# Altium schematic sheet Half_Bridge_Driver.SchDoc
size A4; SheetNumber: 14; SheetTotal: 16
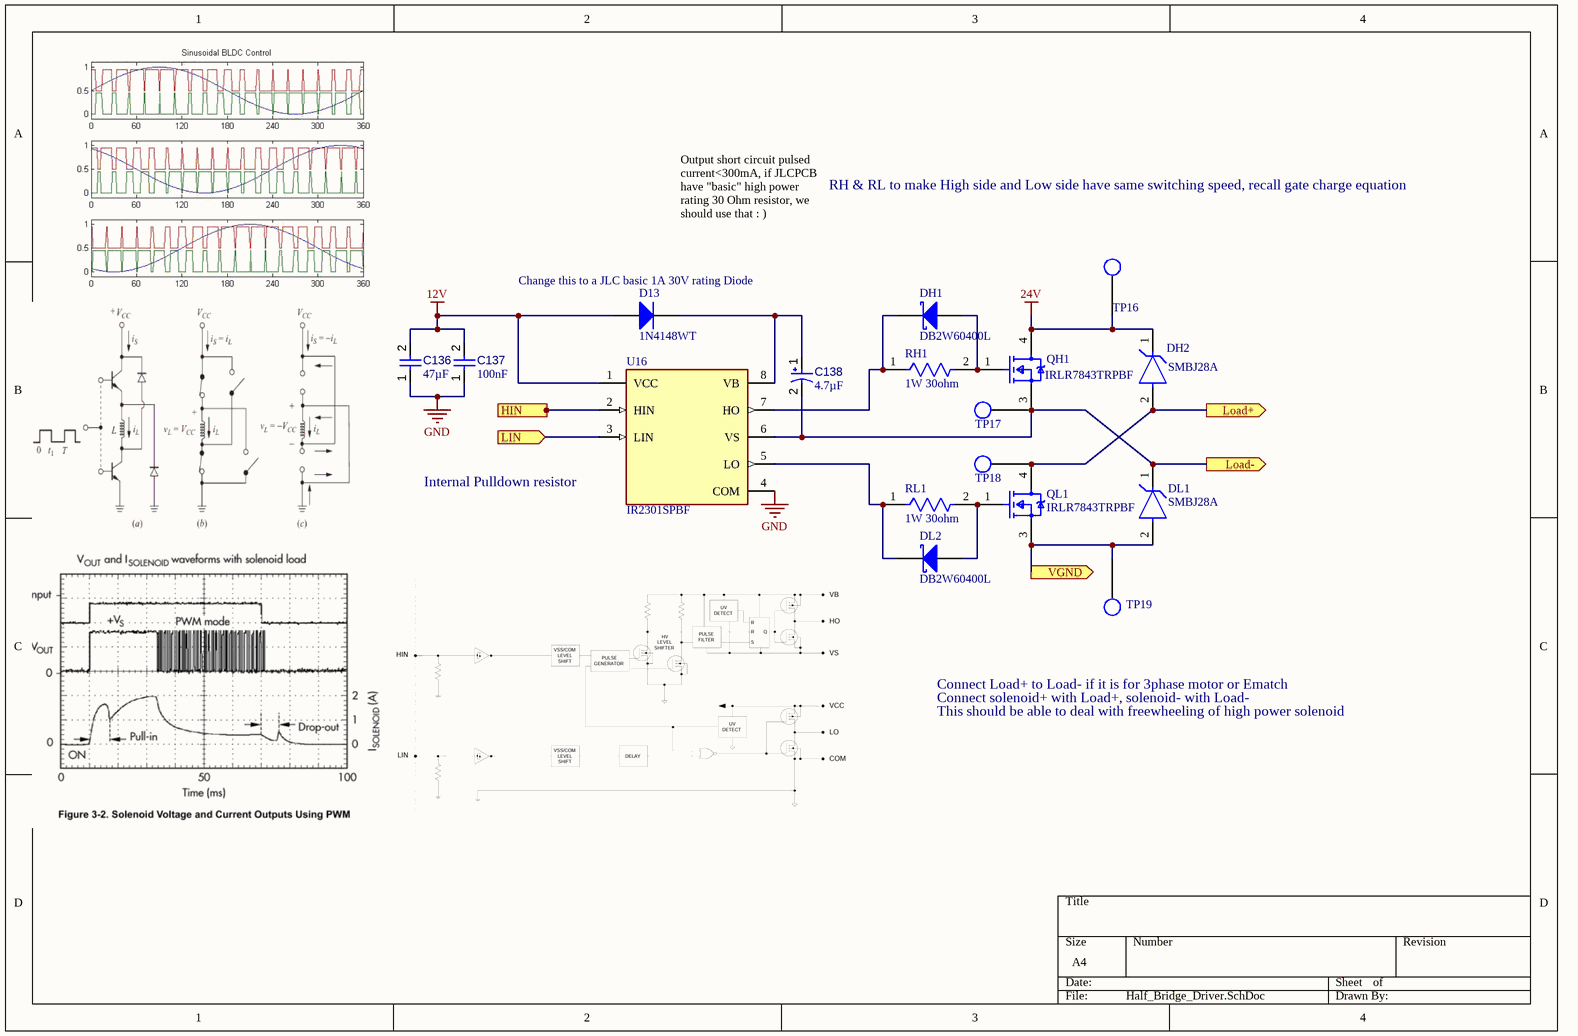
[diagram p0: Half_Bridge_Driver.SchDoc]

## Parts
C136  value 47µF  [CAPC0805(2012)145_L]  (hidden comment: Capacitor 47µF +/-40% 6.3V 0805)
C137  value 100nF  [CAPC2013X95X50LL10T25]  (hidden comment: Capacitor 100 nF +/-10% 50 V 0805)
C138  value 4.7µF  [CAPPR55-200-1100X500X1200]  (hidden comment: ECA1HM4R7)
D13  1N4148WT  [FAIR-SOD-523F-2_V]
DH1  DB2W60400L  [PNSC-Mini2-F3-B-2_V]
DH2  SMBJ28A  [FP-SMBJ-MFG]
DL1  SMBJ28A  [FP-SMBJ-MFG]
DL2  DB2W60400L  [PNSC-Mini2-F3-B-2_V]
QH1  IRLR7843TRPBF  [FP-PG-TO252-3-MFG]
QL1  IRLR7843TRPBF  [FP-PG-TO252-3-MFG]
RH1  1W 30ohm  [FP-RMCF2512-IPC_C]
RL1  1W 30ohm  [FP-RMCF2512-IPC_C]
TP16  BURPG_TestPoint1  [BURPG_TestPoint1]  (value not drawn)  (no BOM)
TP17  BURPG_TestPoint1  [BURPG_TestPoint1]  (value not drawn)  (no BOM)
TP18  BURPG_TestPoint1  [BURPG_TestPoint1]  (value not drawn)  (no BOM)
TP19  BURPG_TestPoint1  [BURPG_TestPoint1]  (value not drawn)  (no BOM)
U16  IR2301SPBF  [FP-PG-DSO-8-IPC_C]

## Ports
HIN (in), LIN (in), Load+ (out), Load- (out), VGND (out)

## Nets
12V: C136.2 C137.2 D13.2(A) U16.1(VCC)
24V: DH2.1(C) QH1.4(DRAIN) TP16.1
GND: C136.1 C137.1 U16.4(COM)
HIN: U16.2(HIN) ; port HIN
LIN: U16.3(LIN) ; port LIN
Load+: DH2.2(A) QL1.4(DRAIN) TP18.1 ; port Load+
Load-: C138.2 DL1.1(C) QH1.3(SOURCE) TP17.1 U16.6(VS) ; port Load-
VGND: DL1.2(A) QL1.3(SOURCE) TP19.1 ; port VGND
NetC138_1: C138.1 D13.1(K) U16.8(VB)
NetDH1_1: DH1.1(A) QH1.1(GATE) RH1.2
NetDH1_2: DH1.2(K) RH1.1 U16.7(HO)
NetDL2_1: DL2.1(A) QL1.1(GATE) RL1.2
NetDL2_2: DL2.2(K) RL1.1 U16.5(LO)

## Notes on the sheet
- Output short circuit pulsed current<300mA, if JLCPCB have "basic" high power rating 30 Ohm resistor, we should use that : )
- RH & RL to make High side and Low side have same switching speed, recall gate charge equation
- (near D13) Change this to a JLC basic 1A 30V rating Diode
- (near U16) Internal Pulldown resistor
- Connect Load+ to Load- if it is for 3phase motor or Ematch
- Connect solenoid+ with Load+, solenoid- with Load-
- This should be able to deal with freewheeling of high power solenoid

## Library data of the parts
C136 = CMP-001-00082-4: Chip Capacitor, 47µF +/-40%, 6.3V, 0805, Thickness 1.45 mm; Tolerance: 10%; Min Operating Temperature: -55°C; Max Operating Temperature: 85°C; Case/Package: 0805; Pins: 2; Mounting Technology: SMT; Voltage Rating: 6.3V
C137 = CMP-001-00018-6: Chip Capacitor, 100 nF, +/- 10%, 50 V, 0805 (2012 Metric); Capacitor Type: Ceramic; Voltage Rating: 50V; Pins: 2; Max Operating Temperature: 125°C; Min Operating Temperature: -55°C; Mounting Technology: SM; Case/Package: 0805; RoHS Compliant: True; Tolerance: 10%
C138 = CMP-001-00033-7: Aluminum Electrolytic Capacitor, 4.7 uF, +/- 20%, 50 V, -40 to 85 degC, 2-Pin THD, RoHS, Bulk; Manufacturer: Panasonic; Ripple Current (AC): 45mA; Voltage Rating: 50V; Diameter: 5mm; Min Operating Temperature: -40°C; Lead Pitch: 2mm; Package Quantity: 200; Capacitor Type: Electrolytic; Ripple Current: 45mA; Datasheet Version: Rev. 05, 10/2016; Case/Package: Radial; Pins: 2; Manufacturer URL: http://www.panasonic.com/; RoHS Compliant: True; Package Description: 2-Pin Radial Lead, Dia 5 mm, Height 12 mm; Packaging: Bulk; Datasheet URL: https://industrial.panasonic.com/cdbs/www-data/pdf/RDF0000/ABA0000C1218.pdf; Mounting Technology: TH; Max Operating Temperature: 85°C; Package Reference: CAPPR55-200-1100X500X1200; Tolerance: 20%
D13 = CMP-0881-00001-1: High Conductance Fast Switching Diode, 75 V, -55 to 150 degC, 2-Pin SOD523F, RoHS; Manufacturer: Fairchild Semiconductor; IR (VR: 75 V)=5 uA Max.; VF: 1 V Max.; BVR (IR: 5 uA)=75 V Min.; CO: 4 pF Max.; DatasheetVersion: Rev. A2; ComponentLink1Description: Manufacturer URL; PackageDescription: 2-Pin Surface Mount Device, Body 1.2 x 0.8 mm, Height 0.7 mm; ComponentLink2URL: http://www.fairchildsemi.com/ds/1N/1N4148WT.pdf; ComponentLink2Description: Datasheet; PartNumber: 1N4148WT; ComponentLink1URL: http://www.fairchildsemi.com/; Temperature Range: -55 to 150 degC; Mounting Technology: Surface Mount; PackageReference: SOD-523F-2; RoHS: TRUE
DH1 DL2 = CMP-2000-06140-1: Schottky Barrier Diode, 60 V (VR), 2 A (IF), -40 to 85 degC, 2-Pin SODFL (Mini2-F3-B), RoHS, Tape and Reel; Manufacturer: Panasonic; Peak Reverse Voltage: 60V; Forward Continuous Current: 2A; Maximum Reverse Leakage Current: 300uA; Max Surge Current: 30A; Configuration: Single; Recovery Time: 12ns; Forward Voltage Drop: 0.66V; Maximum Diode Capacitance: 38pF; Package / Case: SC-109B-2; Mounting Style: SMD/SMT; Maximum Operating Temperature: +85C; Factory Pack Quantity: 3000; Product: GeneralPurposeDiodes; Package Description: 2-Pin Small Outline Transistor Flat Lead, Body 2.6 x 1.6 mm; Datasheet Version: Rev. 3, 04/2013; Package Reference: Mini2-F3-B-2; RoHS: Details; Product Category: Diodes-GeneralPurpose,Power,Switching; Minimum Operating Temperature: -40C; Packaging: Reel; Operating Temperature Range: -40Cto+85C; Mounting Technology: SurfaceMount; Datasheet URL: http://www.semicon.panasonic.co.jp/ds4/DB2W604_E.pdf; Manufacturer URL: http://www.panasonic.com/; Brand: Panasonic
DH2 DL1 = CMP-08607-000081-1: TVS DIODE 28V 45.4V DO214AA; Manufacturer: Littelfuse Inc; Breakdown Voltage: 31.1V; Direction: Unidirectional; Number Of Channels: 1; Peak Pulse Power: 600W; Max Junction Temp: +150°C; Peak Pulse Current: 13.3A; Temperature: -65°C to +150°C; Category: Diode; RoHS: TRUE; Height: 2.61mm; Reverse Standoff Voltage: 28V; Device Class L1: Circuit Protection; Temperature Range Low: -65°C; ComponentLink2Description: Datasheet; Digikey Description: TVS DIODE 28V 45.4V DO214AA; Automotive: No; Package: SMBJ; Mouser Description: Littelfuse SMBJ28A, Uni-Directional TVS Diode, 600W, 2-Pin DO-214AA; ComponentLink2URL: https://www.littelfuse.com/~/media/electronics/datasheets/tvs_diodes/littelfuse_tvs_diode_smbj_datasheet.pdf.pdf; Manufacturer Part Number: SMBJ28A; Octopart: https://octopart.com/smbj28a-littelfuse-350790; Clamping Voltage: 45.4V; Temperature Range High: +150°C; Device Class L3: unset; Device Class L2: TVS Diodes; Lead Free: Yes
QH1 QL1 = CMP-32901-000143-1: MOSFET N-CH 30V 161A DPAK; Manufacturer: Infineon; Drain To Source Resistance: 3.2mΩ; Depletion Mode: False; Reverse Recovery Time: 39ns; Reverse Recovery Charge: 36nC; Threshold Vgs Max: 2.3V; Rthja Max: 50°C/W; Threshold Vgs Min: 1.4V; Power Dissipation: 140W; Pulse Drain Current: 620A; Input Capacitace At Vds: 4380pF @ 15V; Turn On Delay Time: 25ns; Gate To Source Voltage: 20V; Max Forward Diode Voltage: 1V; Gate Charge At Vgs: 34nC @ 4.5V; Max Junction Temp: +175°C; Number Of Channels: 1; Turn Off Delay Time: 34ns; ComponentLink2URL: https://www.infineon.com/dgdl/irlr7843pbf.pdf?fileId=5546d462533600a40153566de53526d8; Temperature Range High: +175°C; Octopart: https://octopart.com/irlr7843trpbf-infineon-65875062; Temperature: -55°C to +175°C; Device Class L3: MOSFETs; Manufacturer Part Number: IRLR7843TRPBF; Category: Trans; Package: PG-TO252-3; Footprint Url: https://www.infineon.com/cms/en/product/packages/PG-TO252/PG-TO252-3-901/; Continuous Drain Current: 161A; Digikey Description: MOSFET N-CH 30V 161A DPAK; Automotive: No; Lead Free: Yes; Drain To Source Breakdown Voltage: 30V; Height: 2.52mm; Temperature Range Low: -55°C; RoHS: TRUE; Number Of N Channels: 1; Drain To Source Voltage: 30V; ComponentLink2Description: Datasheet; Device Class L2: Transistors; Device Class L1: Discrete Semiconductors
RH1 RL1 = CMP-26527-003100-1: 30Ω ±5% 1W 2512 Thick Film Chip Resistor AEC-Q200 compliant; Temperature Coefficient: 100ppm/°C; Resistance: 30R; RoHS Compliant: Yes; Length: 0.248inch; Size Code: 2512; Height: 0.028inch; Resistor Type: Thick Film; Contact Plating: Tin; Radiation Hardening: No; Case Code (Metric): 6432; Mount: Surface Mount; Lead Free: Lead Free; Width: 0.126inch; Case Code (Imperial): 2512; Packaging: Tape and Reel; Number of Terminations: 2; Series: RMCF; Case/Package: 2512; Min Operating Temperature: -55°C; Max Power Dissipation: 1W; Features: Automotive AEC-Q200; Max Operating Temperature: 155°C; Power Rating: 1W; Tolerance: 5%
U16 = CMP-32851-000095-1: IC GATE DRVR HI/LOW SIDE 8SOIC; Max Supply Voltage: 20V; Min Supply Voltage: 5V; Fall Time: 80ns; Number of Drivers: 2; Channel Type: Independent; Max Output Current: 350mA; Propagation Delay: 220ns; Output Voltage: 620V; Number of Pins: 8; Min Operating Temperature: -40°C; Lead Free: Lead Free; Halogen Free: Not Halogen Free; Width: 0.157inch; Case/Package: SOIC; Max Operating Temperature: 150°C; Height: 0.059inch; Packaging: Rail/Tube; Number of Channels: 2; RoHS Compliant: Yes; Series: -; Output Current: 350mA; Mount: Surface Mount; Length: 0.196inch; Number of Outputs: 2; Package Quantity: 95; REACH SVHC: No SVHC